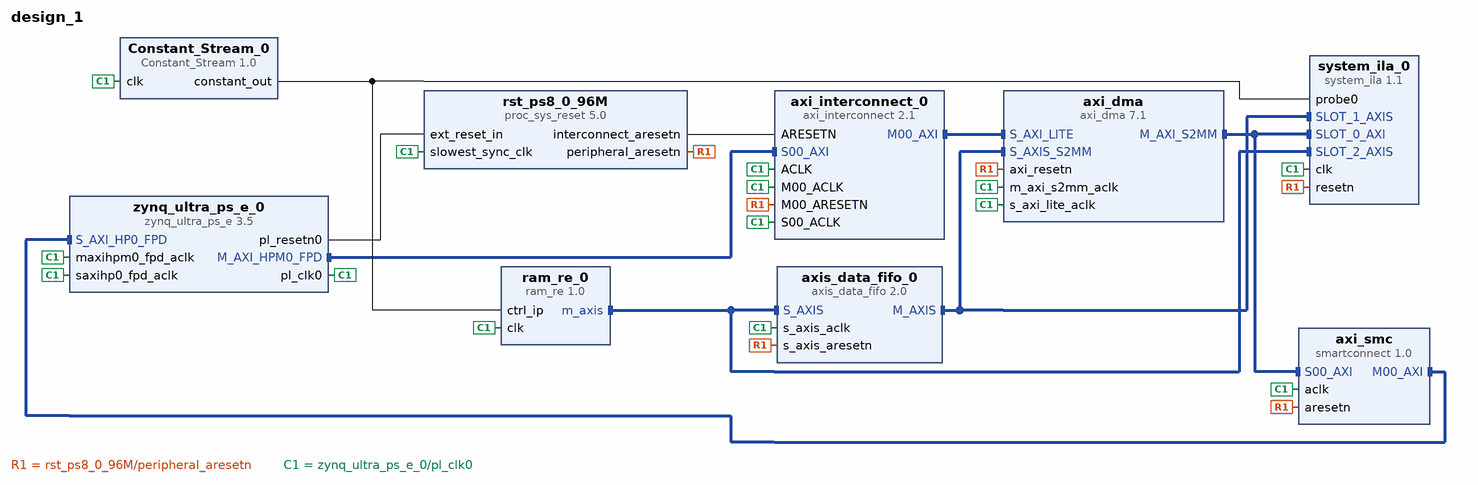
[diagram p0: block diagram of the top level]
# Vivado block design design_1, xczu28dr-ffvg1517-2-e, Vivado 2024.1
create_bd_design design_1

create_bd_cell -type ip -vlnv CoRSoC:VMC:Constant_Stream:1.0 Constant_Stream_0
create_bd_cell -type ip -vlnv CoRSoC:VMC:ram_re:1.0 ram_re_0
create_bd_cell -type ip -vlnv xilinx.com:ip:zynq_ultra_ps_e:3.5 zynq_ultra_ps_e_0
set_property -dict [list \
  CONFIG.PSU__DDR_HIGH_ADDRESS_GUI_ENABLE 0 \
  CONFIG.PSU__MAXIGP0__DATA_WIDTH 128 \
  CONFIG.PSU__USE__M_AXI_GP0 1 \
  CONFIG.PSU__USE__M_AXI_GP2 0 \
  CONFIG.PSU__USE__S_AXI_GP2 1 \
] [get_bd_cells zynq_ultra_ps_e_0]
# 5 more settings of zynq_ultra_ps_e_0 are not shown: defaults, MIO pin electricals, DDR timing, and values the tool derives
create_bd_cell -type ip -vlnv xilinx.com:ip:axi_interconnect:2.1 axi_interconnect_0
set_property -dict {CONFIG.NUM_MI 1} [get_bd_cells axi_interconnect_0]
create_bd_cell -type ip -vlnv xilinx.com:ip:axis_data_fifo:2.0 axis_data_fifo_0
set_property -dict {CONFIG.FIFO_DEPTH 1024 CONFIG.HAS_TLAST 1} [get_bd_cells axis_data_fifo_0]
create_bd_cell -type ip -vlnv xilinx.com:ip:axi_dma:7.1 axi_dma
set_property -dict [list \
  CONFIG.c_include_mm2s 0 \
  CONFIG.c_include_s2mm_dre 1 \
  CONFIG.c_include_sg 0 \
  CONFIG.c_s2mm_burst_size 256 \
] [get_bd_cells axi_dma]
create_bd_cell -type ip -vlnv xilinx.com:ip:smartconnect:1.0 axi_smc
set_property -dict {CONFIG.NUM_SI 1} [get_bd_cells axi_smc]
create_bd_cell -type ip -vlnv xilinx.com:ip:proc_sys_reset:5.0 rst_ps8_0_96M
create_bd_cell -type ip -vlnv xilinx.com:ip:system_ila:1.1 system_ila_0
set_property -dict [list \
  CONFIG.C_MON_TYPE MIX \
  CONFIG.C_NUM_MONITOR_SLOTS 3 \
  CONFIG.C_NUM_OF_PROBES 1 \
  CONFIG.C_PROBE0_TYPE 0 \
  CONFIG.C_SLOT_0_APC_EN 0 \
  CONFIG.C_SLOT_0_AXI_AR_SEL_DATA 0 \
  CONFIG.C_SLOT_0_AXI_AR_SEL_TRIG 0 \
  CONFIG.C_SLOT_0_AXI_AW_SEL_DATA 1 \
  CONFIG.C_SLOT_0_AXI_AW_SEL_TRIG 1 \
  CONFIG.C_SLOT_0_AXI_B_SEL_DATA 1 \
  CONFIG.C_SLOT_0_AXI_B_SEL_TRIG 1 \
  CONFIG.C_SLOT_0_AXI_R_SEL_DATA 0 \
  CONFIG.C_SLOT_0_AXI_R_SEL_TRIG 0 \
  CONFIG.C_SLOT_0_AXI_W_SEL_DATA 1 \
  CONFIG.C_SLOT_0_AXI_W_SEL_TRIG 1 \
  CONFIG.C_SLOT_0_INTF_TYPE xilinx.com:interface:aximm_rtl:1.0 \
  CONFIG.C_SLOT_1_APC_EN 0 \
  CONFIG.C_SLOT_1_AXI_DATA_SEL 1 \
  CONFIG.C_SLOT_1_AXI_TRIG_SEL 1 \
  CONFIG.C_SLOT_1_INTF_TYPE xilinx.com:interface:axis_rtl:1.0 \
  CONFIG.C_SLOT_2_APC_EN 0 \
  CONFIG.C_SLOT_2_AXI_DATA_SEL 1 \
  CONFIG.C_SLOT_2_AXI_TRIG_SEL 1 \
  CONFIG.C_SLOT_2_INTF_TYPE xilinx.com:interface:axis_rtl:1.0 \
] [get_bd_cells system_ila_0]

# ---- connections ----

connect_bd_intf_net -intf_net axi_dma_M_AXI_S2MM [get_bd_intf_pins axi_dma/M_AXI_S2MM] [get_bd_intf_pins axi_smc/S00_AXI]
connect_bd_intf_net [get_bd_intf_pins axi_dma/M_AXI_S2MM] [get_bd_intf_pins system_ila_0/SLOT_0_AXI]
connect_bd_intf_net [get_bd_intf_pins axi_dma/S_AXI_LITE] [get_bd_intf_pins axi_interconnect_0/M00_AXI]
connect_bd_intf_net [get_bd_intf_pins axi_smc/M00_AXI] [get_bd_intf_pins zynq_ultra_ps_e_0/S_AXI_HP0_FPD]
connect_bd_intf_net -intf_net axis_data_fifo_0_M_AXIS [get_bd_intf_pins axis_data_fifo_0/M_AXIS] [get_bd_intf_pins axi_dma/S_AXIS_S2MM]
connect_bd_intf_net [get_bd_intf_pins axis_data_fifo_0/M_AXIS] [get_bd_intf_pins system_ila_0/SLOT_1_AXIS]
connect_bd_intf_net -intf_net ram_re_0_m_axis [get_bd_intf_pins ram_re_0/m_axis] [get_bd_intf_pins axis_data_fifo_0/S_AXIS]
connect_bd_intf_net [get_bd_intf_pins ram_re_0/m_axis] [get_bd_intf_pins system_ila_0/SLOT_2_AXIS]
connect_bd_intf_net [get_bd_intf_pins zynq_ultra_ps_e_0/M_AXI_HPM0_FPD] [get_bd_intf_pins axi_interconnect_0/S00_AXI]
connect_bd_net -net Constant_Stream_0_constant_out [get_bd_pins Constant_Stream_0/constant_out] \
  [get_bd_pins ram_re_0/ctrl_ip] [get_bd_pins system_ila_0/probe0]
connect_bd_net [get_bd_pins rst_ps8_0_96M/interconnect_aresetn] [get_bd_pins axi_interconnect_0/ARESETN]
connect_bd_net [get_bd_pins rst_ps8_0_96M/peripheral_aresetn] \
  [get_bd_pins axi_smc/aresetn] [get_bd_pins axis_data_fifo_0/s_axis_aresetn] [get_bd_pins axi_dma/axi_resetn] \
  [get_bd_pins axi_interconnect_0/M00_ARESETN] [get_bd_pins system_ila_0/resetn]
connect_bd_net [get_bd_pins zynq_ultra_ps_e_0/pl_clk0] \
  [get_bd_pins axi_interconnect_0/ACLK] [get_bd_pins axi_interconnect_0/S00_ACLK] [get_bd_pins axi_interconnect_0/M00_ACLK] \
  [get_bd_pins zynq_ultra_ps_e_0/maxihpm0_fpd_aclk] [get_bd_pins ram_re_0/clk] [get_bd_pins Constant_Stream_0/clk] \
  [get_bd_pins axis_data_fifo_0/s_axis_aclk] [get_bd_pins axi_dma/m_axi_s2mm_aclk] [get_bd_pins axi_smc/aclk] \
  [get_bd_pins zynq_ultra_ps_e_0/saxihp0_fpd_aclk] [get_bd_pins rst_ps8_0_96M/slowest_sync_clk] \
  [get_bd_pins axi_dma/s_axi_lite_aclk] [get_bd_pins system_ila_0/clk]
connect_bd_net [get_bd_pins zynq_ultra_ps_e_0/pl_resetn0] [get_bd_pins rst_ps8_0_96M/ext_reset_in]
set_property HDL_ATTRIBUTE.DEBUG true [get_bd_intf_nets axi_dma_M_AXI_S2MM]
set_property HDL_ATTRIBUTE.MARK_DEBUG true [get_bd_intf_nets axi_dma_M_AXI_S2MM]
set_property HDL_ATTRIBUTE.DEBUG true [get_bd_intf_nets axis_data_fifo_0_M_AXIS]
set_property HDL_ATTRIBUTE.MARK_DEBUG true [get_bd_intf_nets axis_data_fifo_0_M_AXIS]
set_property HDL_ATTRIBUTE.DEBUG true [get_bd_intf_nets ram_re_0_m_axis]
set_property HDL_ATTRIBUTE.MARK_DEBUG true [get_bd_intf_nets ram_re_0_m_axis]
set_property HDL_ATTRIBUTE.DEBUG true [get_bd_nets Constant_Stream_0_constant_out]
set_property HDL_ATTRIBUTE.MARK_DEBUG true [get_bd_nets Constant_Stream_0_constant_out]

# ---- address map ----
assign_bd_address -offset 0x00000000 -range 2G -target_address_space [get_bd_addr_spaces axi_dma/Data_S2MM] [get_bd_addr_segs zynq_ultra_ps_e_0/SAXIGP2/HP0_DDR_LOW]
exclude_bd_addr_seg -offset 0xFF000000 -range 16M -target_address_space [get_bd_addr_spaces axi_dma/Data_S2MM] [get_bd_addr_segs zynq_ultra_ps_e_0/SAXIGP2/HP0_LPS_OCM]
assign_bd_address -offset 0x00A0000000 -range 64K -target_address_space [get_bd_addr_spaces zynq_ultra_ps_e_0/Data] [get_bd_addr_segs axi_dma/S_AXI_LITE/Reg]

validate_bd_design
save_bd_design
